# Altium schematic sheet Temp Sense.SchDoc
size A4; SheetNumber: 5; SheetTotal: 5
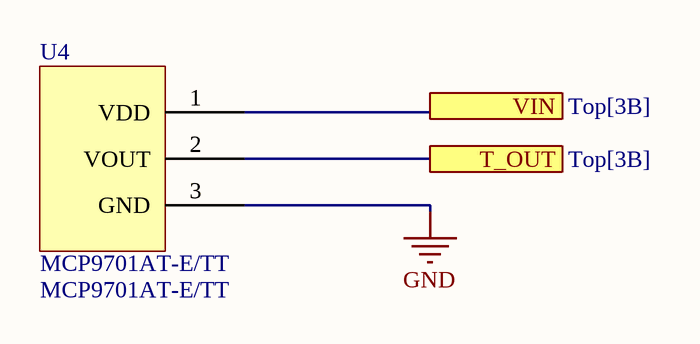
[diagram p0: Temp Sense.SchDoc]

## Parts
U4  MCP9701AT-E/TT  [MCP9701AT-E/TT]

## Ports
T_OUT (see Top[3B]), VIN (see Top[3B])

## Nets
GND: U4.3(GND)
T_OUT: U4.2(VOUT) ; port T_OUT
VIN: U4.1(VDD) ; port VIN

## Library data of the parts
U4 = MCP9701AT-E/TT: IC THERMISTOR; Manufacturer 1: Microchip Technology; Supplier Part Number 1: MCP9701AT-E/TTTR-ND; Supplier 1: Digi-Key; Manufacturer Part Number 1: MCP9701AT-E/TT